# Altium schematic sheet Power.SchDoc
size A4; SheetNumber: 1; SheetTotal: 4
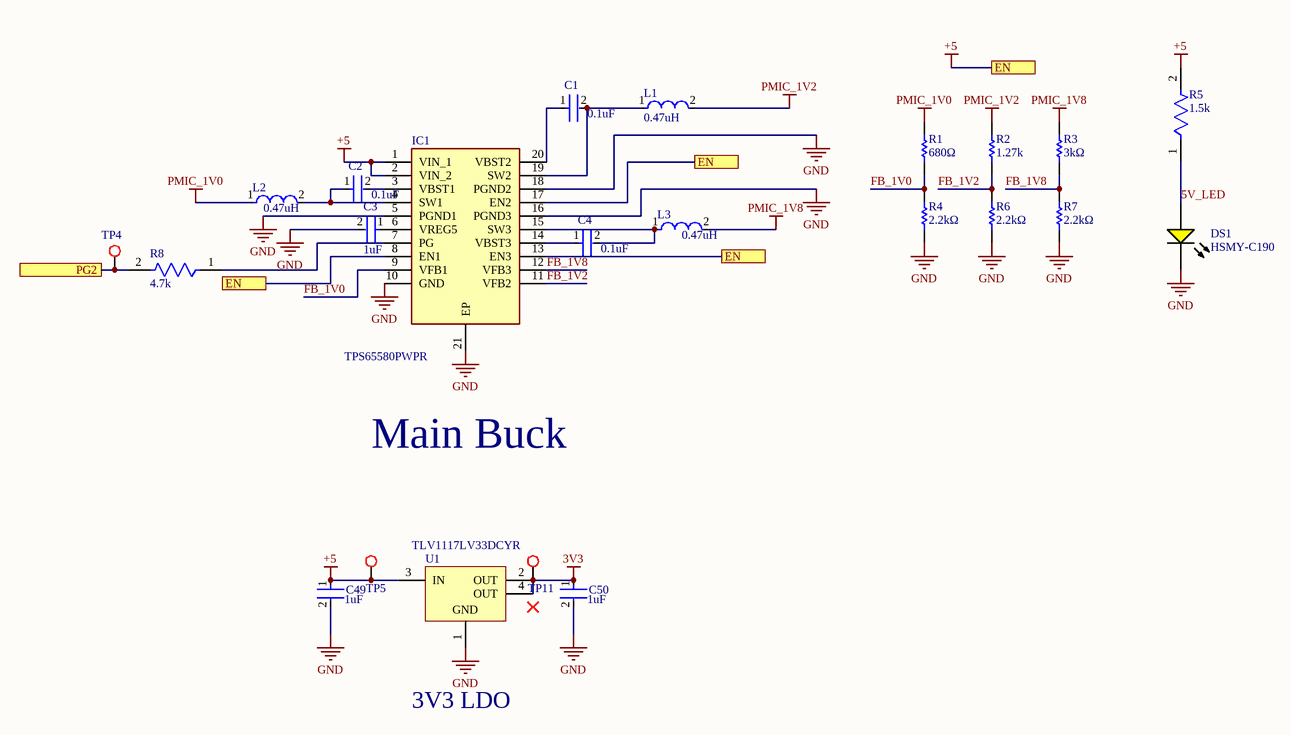
[diagram p0: Power.SchDoc]

## Parts
C1  0.1uF  [FP-0603-L_1_6_0_1-W_0_8_0-IPC_C]
C2  0.1uF  [FP-0603-L_1_6_0_1-W_0_8_0-IPC_C]
C3  1uF  [FP-CL10-IPC_C]
C4  0.1uF  [FP-0603-L_1_6_0_1-W_0_8_0-IPC_C]
C49  1uF  [FP-CL10-IPC_C]
C50  1uF  [FP-CL10-IPC_C]
DS1  HSMY-C190  [AVAG-HSMX-C190_V]
IC1  TPS65580PWPR  [SOP65P640X120-21N]
L1  0.47uH  [FP-IHLP-3232DZ-FP_2_413x5-MFG]
L2  0.47uH  [FP-IHLP-3232DZ-FP_2_413x5-MFG]
L3  0.47uH  [FP-IHLP-3232DZ-FP_2_413x5-MFG]
R1  680Ω  [RESC1608X55X30NL20T10]
R2  1.27k  [RESC1609X50X30NL10T20]
R3  3kΩ  [RESC1608X55X30NL20T10]
R4  2.2kΩ  [RESC1609X50X30NL10T20]
R5  1.5k  [FP-RC1608-IPC_B]
R6  2.2kΩ  [RESC1609X50X30NL10T20]
R7  2.2kΩ  [RESC1609X50X30NL10T20]
R8  4.7k  [FP-CRCW0603-HPe3-IPC_A]
TP4  TP_1  [Testpoint]  (value not drawn)
TP5  TP  [Testpoint]  (value not drawn)  (no BOM)
TP11  TP  [Testpoint]  (value not drawn)  (no BOM)
U1  TLV1117LV33DCYR  [DCY0004A_N]

## Ports
EN (see Power[1B], Power[3A]), EN (see Power[1B], Power[3A], Power[3B]), EN (see Power[3A], Power[3B]), PG2 (see IWRL6432[4C])

## Nets
3V3: C50.1 TP11.0 U1.2(OUT) U1.4(OUT)
+5: C49.1 IC1.1(VIN_1) IC1.2(VIN_2) IC1.8(EN1) IC1.13(EN3) IC1.17(EN2) R5.2 TP5.0 U1.3(IN) ; port EN
GND: C3.2 C49.2 C50.2 DS1.2(K) IC1.5(PGND1) IC1.10(GND) IC1.16(PGND3) IC1.18(PGND2) IC1.21(EP) R4.1 R6.1 R7.1 U1.1(GND)
PMIC_1V0: L2.1 R1.2
PMIC_1V2: L1.2 R2.2
PMIC_1V8: L3.2 R3.2
5V_LED: DS1.1(A) R5.1
FB_1V0: IC1.9(VFB1) R1.1 R4.2
FB_1V2: IC1.11(VFB2) R2.1 R6.2
FB_1V8: IC1.12(VFB3) R3.1 R7.2
PG2: R8.2 TP4.0 ; port PG2
NetC1_1: C1.1 IC1.20(VBST2)
NetC1_2: C1.2 IC1.19(SW2) L1.1
NetC2_1: C2.1 IC1.4(SW1) L2.2
NetC2_2: C2.2 IC1.3(VBST1)
NetC3_1: C3.1 IC1.6(VREG5)
NetC4_1: C4.1 IC1.14(VBST3)
NetC4_2: C4.2 IC1.15(SW3) L3.1
NetIC1_7: IC1.7(PG) R8.1

## Notes on the sheet
- Main Buck
- 3V3 LDO

## Library data of the parts
C1 C2 C4 = CMP-14477-001640-2: None; Dielectric: X7R; Tolerance: 10%; Voltage Rating (DC): 25V; Capacitance: 100nF; Mount: Surface Mount; Thickness: 0.035inch; Packaging: Tape and Reel; Termination: SMD/SMT; Halogen Free: Halogen Free; RoHS Compliant: Yes; Case Code (Metric): 1608; Min Operating Temperature: -55°C; Width: 0.031inch; Voltage Rating: 25V; Package Quantity: 1; Case Code (Imperial): 0603; Ratings: AEC-Q200; Lead Free: Lead Free; Length: 0.063inch; Height: 0.8mm; Case/Package: 0603; Max Operating Temperature: 125°C
C3 C49 C50 = CMP-13271-003399-1: Cap Ceramic 1uF 10V X5R ±10% Pad SMD 0603 +85°C T/R; Min Operating Temperature: -55°C; Max Operating Temperature: 85°C; Dielectric: X5R; Contact Plating: Tin; Height: 0.8mm; Voltage: 10V; Packaging: Tape and Reel; Voltage Rating: 10V; Capacitance: 1uF; Package Quantity: 1; Width: 0.031inch; Length: 1.6mm; Depth: 0.8mm; Case/Package: 0603; Case Code (Imperial): 0603; Thickness: 0.035inch; Radiation Hardening: No; Tolerance: 10%; Case Code (Metric): 1608; Mount: Surface Mount
DS1 = CMP-1744-00003-1: LED Uni-Color Yellow, 65 mW, 20 mA, -40 to 85 degC, 2-Pin SMD, RoHS, Tape and Reel; Tolerance: 1%; Voltage Rating: 50 V; Power Rating: 100 mW; Case\Package: 0603; Resistance: 390 Ohm; Min Operating Temperature: -55 degC; Length: 1.6 mm; ComponentLink3Description: Package Specification; Mount: Surface Mount; PackageReference: HSMX-C190; ComponentLink2Description: Datasheet; DatasheetVersion: Mar-12; Case Code (Metric): 1608; Pins: 2; Package Quantity: 5000; ComponentLink2URL: http://docs.avagotech.com/docs/AV02-0551EN; ComponentLink1Description: Manufacturer URL; RoHSCompliant: true; Packaging: Tape and Reel; PackageDescription: 2-Pin Surface Mount Device, Body 1.6 x 0.8 mm, Height 0.9 mm; REACH SVHC: No SVHC; ComponentLink3URL: http://www.fairchildsemi.com/dwg/MA/MA03D.pdf; Voltage Rating (DC): 50 V; Width: 0.8 mm; ComponentLink1URL: http://www.avagotech.com/; Max Operating Temperature: 155 degC; Case Code (Imperial): 0603; Height: 0.45 mm
IC1 = TPS65580PWPR: Integrated Circuit; Manufacturer_Name: Texas Instruments; Datasheet Link: http://www.ti.com/lit/gpn/tps65580; Height: 1.2mm; Manufacturer_Part_Number: TPS65580PWPR; Mouser Part Number: 595-TPS65580PWPR; Mouser Price/Stock: https://www.mouser.co.uk/ProductDetail/Texas-Instruments/TPS65580PWPR?qs=igp4D3uu33KIVxsJeGysbA%3D%3D; Arrow Part Number: TPS65580PWPR; Arrow Price/Stock: https://www.arrow.com/en/products/tps65580pwpr/texas-instruments?region=nac
L1-L3 = CMP-02424-000394-1: Commercial Inductors, Low DCR Series 0.47uH 25A 2.38mΩ 20%; Shielding: Shielded; Saturation Current: 14A; Core Material: Ferrite; Test Frequency: 100kHz; Self Resonant Frequency: 80MHz; Inductance: 470nH; DC Resistance (DCR): 2.38mR; Tolerance: 20%; Length: 0.34inch; Width: 0.322inch; Height: 4mm; Case/Package: 3232; Height - Seated (Max): 0.157inch; Termination: SMD/SMT; Inductance Tolerance: 20%; Depth: 8.94mm; Number of Pins: 2; Radiation Hardening: No; Min Operating Temperature: -55°C; Package Quantity: 500; Current Rating: 25A; Mount: Surface Mount; RMS Current (Irms): 25A; Military Standard: Not; Max Operating Temperature: 125°C; Lead Free: Lead Free; Max DC Current: 14A; Packaging: Tape and Reel
R1 = CMP-2000-01638-1: Manufacturer: KOA Speer; Part Number: RK73H1JTTD6800F
R2 = CMP-1012-00521-2: Part Number: CRCW06031K27FKEA; Manufacturer: Vishay Dale
R3 = CMP-2000-01790-1: Manufacturer: KOA Speer; Part Number: SG73P1JTTD3001F
R4 R6 R7 = CMP-2000-03167-1: Part Number: CRCW06032K20FKEA; Manufacturer: Vishay Dale
R5 = CMP-13261-004935-1: Res Thick Film 0603 1.5kΩ 1% 0.1W ±100ppm/°C Molded SMD T/R; Resistance: 1.5kR; Voltage Rating (DC): 50V; Power Rating: 100mW; Contact Plating: Tin; Depth: 0.8mm; Width: 800um; Tolerance: 1%; Lead Free: Lead Free; Composition: Thick Film; Military Standard: Not; Temperature Coefficient: 100ppm/°C; Radiation Hardening: No; Length: 1.6mm; Case/Package: 0603; Max Operating Temperature: 155°C; Packaging: Tape and Reel; Min Operating Temperature: -55°C
R8 = CMP-2000-03414-2: RES Thick Film, 4.7kΩ, 5%, 0.33W, 200ppm/°C, 0603; Max Power Dissipation: 250mW; Voltage Rating: 75V; Resistance: 4.7kR; Case/Package: 0603; Lead Free: Lead Free; Tolerance: 5%; Max Operating Temperature: 155°C; RoHS Compliant: Yes; Power Rating: 250mW; Features: Automotive AEC-Q200; Resistor Type: Thick Film; Weight: 7.1E-05oz; Width: 0.033inch; Packaging: Tape and Reel; Case Code (Imperial): 0603; Package Quantity: 1; Contact Plating: Tin; Number of Terminations: 2; Min Operating Temperature: -55°C; Radiation Hardening: No; Case Code (Metric): 1608; Temperature Coefficient: 200ppm/°C; Height: 0.022inch; Length: 0.063inch; Series: CRCW-HP
TP4 TP5 TP11 = Testpoint
U1 = CMP-0395-00503-2: Single Output LDO, 1 A, Fixed 3.3 V Output, 2 to 5.5 V Input, 4-pin SOT-223 (DCY), -40 to 125 degC, Green (RoHS & no Sb/Br); Manufacturer: Texas Instruments; Vout Adj(Min)(V): 3.3; Vdo(Typ)(mV): 1200; Iq(Typ)(mA): 0.05; Accuracy(%): 2; Iout(Max)(A): 1; SubFamily: Single Channel LDO; Vin(Max)(V): 5.5; PackageReference: DCY0004A; PackageDescription: 4-Pin Plastic Small Outline, Body 3.5 x 6.5 mm, Pitch 2.3 mm; Vout Adj(Max)(V): 3.3; Mounting Technology: Surface Mount; ComponentLink2Description: Datasheet; ComponentLink1Description: Manufacturer URL; PartNumber: TLV1117LV33DCYR; ComponentLink3Description: Package Specification; ComponentLink1URL: http://www.ti.com/; ComponentLink2URL: http://www.ti.com/general/docs/lit/getliterature.tsp?genericPartNumber=TLV1117LV33&fileType=pdf; Fixed Output Options(V): 3.3; PackageVersion: 4202506/B; Vin(Min)(V): 2; DatasheetVersion: SBVS160A; Eco-Plan: Green (RoHS & no Sb/Br); ComponentLink3URL: http://www.ti.com/litv/pdf/mpds094a; Code_JEDEC: TO-261